# Altium schematic sheet Messsystem.SchDoc: Messsystem
size A4; Author: Andreas Rehn; CompanyName: Hochschule Ulm; Engineer: Andreas Rehn; Organization: Hochschule Ulm; Address1: Institut für Medizintechnik; Address2: und Mechatronik; Address3: Albert-Einstein-Allee 55; Address4: 89081 Ulm; SheetNumber: 2; SheetTotal: 11; ProjectName: Ultrasonic Doppler 2015
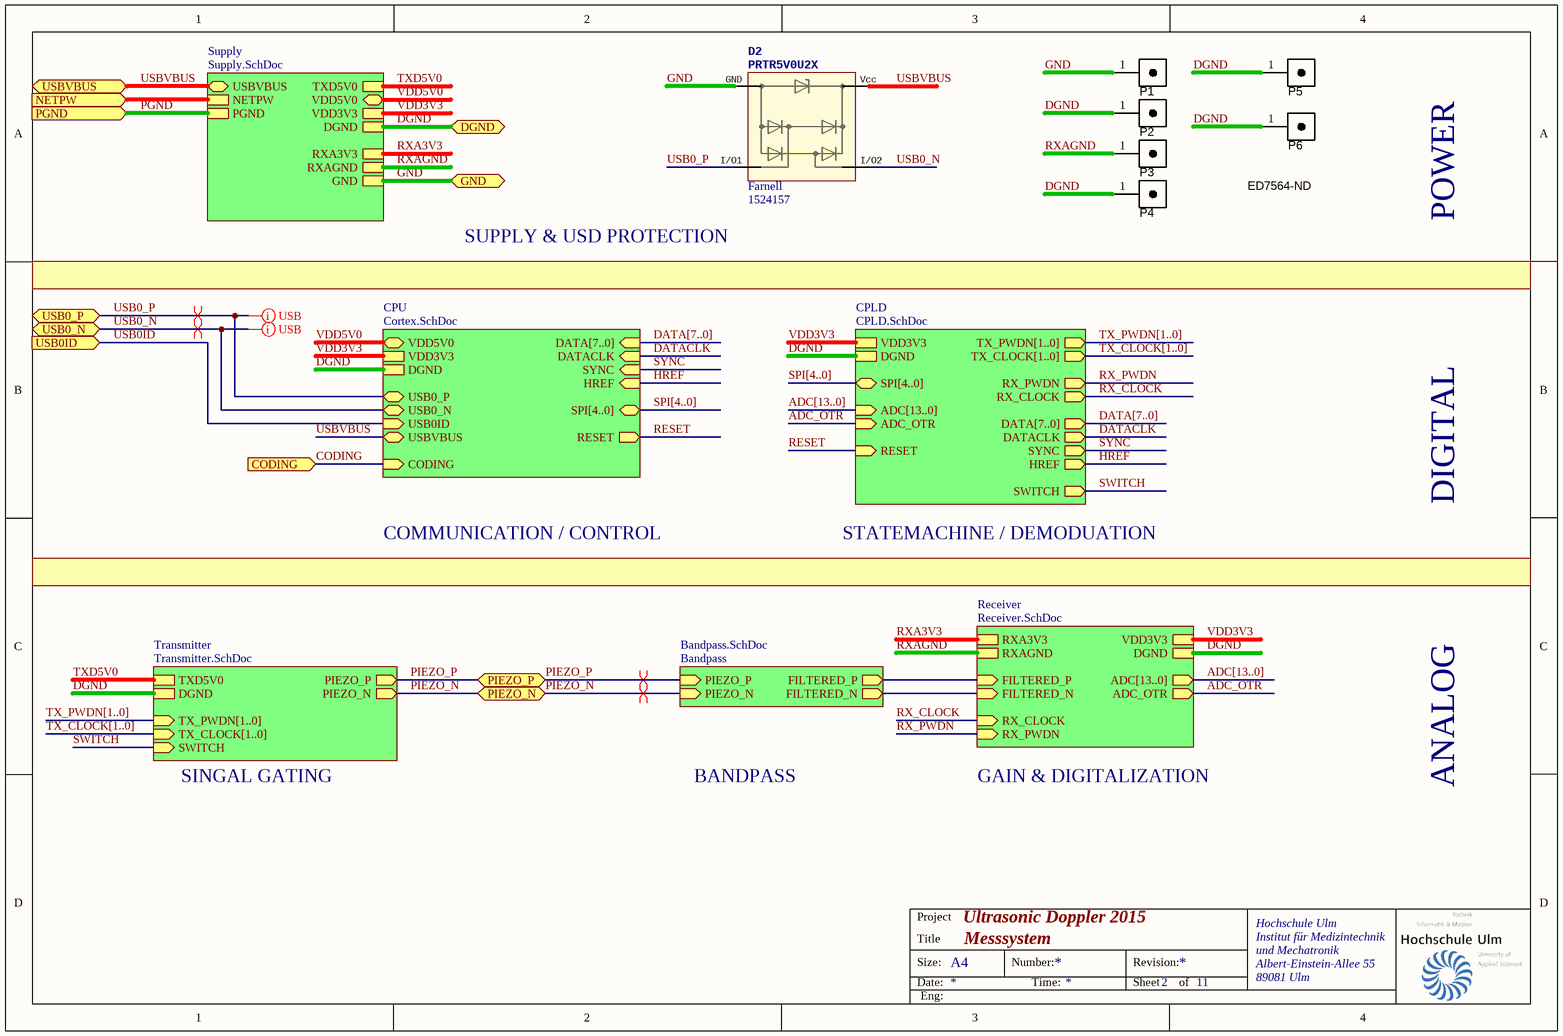
[diagram p0: Messsystem.SchDoc]

## Parts
D2  PRTR5V0U2X  Supplier 1: Farnell  Supplier Part Number 1: 1524157  [SOT143-B]
P1  CONN_HEADER_PLUG_1x1P_0.100in  [1x1POS_HEADER_LOWPROF]  (value not drawn)
P2  CONN_HEADER_PLUG_1x1P_0.100in  [1x1POS_HEADER_LOWPROF]  (value not drawn)
P3  CONN_HEADER_PLUG_1x1P_0.100in  [1x1POS_HEADER_LOWPROF]  (value not drawn)
P4  Supplier Part Number 1: ED7564-ND  [1x1POS_HEADER_LOWPROF]  (hidden comment: CONN_HEADER_PLUG_1x1P_0.100in)
P5  CONN_HEADER_PLUG_1x1P_0.100in  [1x1POS_HEADER_LOWPROF]  (value not drawn)
P6  CONN_HEADER_PLUG_1x1P_0.100in  [1x1POS_HEADER_LOWPROF]  (value not drawn)

## Sub-sheets
Bandpass = Bandpass.SchDoc: FILTERED_P, FILTERED_N, PIEZO_P, PIEZO_N
CPLD = CPLD.SchDoc: DATA[7..0] (out), VDD3V3, DGND, DATACLK (out), SYNC (out), TX_PWDN[1..0] (out), TX_CLOCK[1..0] (out), RX_CLOCK (out), RX_PWDN (out), ADC[13..0] (in), ADC_OTR (in), SPI[4..0], SWITCH (out), HREF (out), RESET (in)
CPU = Cortex.SchDoc: DATA[7..0] (in), VDD3V3, DGND, DATACLK (in), SYNC (in), USB0_P (bidir), USB0_N (bidir), SPI[4..0], USB0ID (in), USBVBUS (bidir), CODING (in), HREF (in), RESET (out), VDD5V0
Receiver = Receiver.SchDoc: RXA3V3, VDD3V3, DGND, ADC[13..0] (out), RX_CLOCK (in), RX_PWDN (in), ADC_OTR (out), FILTERED_P, FILTERED_N, RXAGND
Supply = Supply.SchDoc: USBVBUS (bidir), PGND, TXD5V0, VDD3V3, RXA3V3, DGND, NETPW, VDD5V0, RXAGND, GND
Transmitter = Transmitter.SchDoc: TXD5V0, TX_PWDN[1..0] (in), TX_CLOCK[1..0] (in), DGND, PIEZO_P, PIEZO_N, SWITCH (in)

## Ports
CODING (in), DGND, GND, NETPW, PGND, PIEZO_N, PIEZO_P, USB0_N (bidir), USB0_P (bidir), USB0ID (in), USBVBUS (bidir)

## Nets
ADC_OTR: sheet Receiver/ADC_OTR, sheet CPLD/ADC_OTR
CODING: port CODING, sheet CPU/CODING
DATACLK: sheet CPU/DATACLK, sheet CPLD/DATACLK
DGND: P2.1 P4.1 P5.1 P6.1 ; port DGND, sheet Supply/DGND, sheet Transmitter/DGND, sheet Receiver/DGND, sheet CPU/DGND, sheet CPLD/DGND
GND: D2.GND P1.1 ; port GND, sheet Supply/GND
HREF: sheet CPU/HREF, sheet CPLD/HREF
NETPW: port NETPW, sheet Supply/NETPW
PGND: port PGND, sheet Supply/PGND
PIEZO_N: port PIEZO_N, sheet Transmitter/PIEZO_N, sheet Bandpass/PIEZO_N
PIEZO_P: port PIEZO_P, sheet Transmitter/PIEZO_P, sheet Bandpass/PIEZO_P
RESET: sheet CPU/RESET, sheet CPLD/RESET
RX_CLOCK: sheet Receiver/RX_CLOCK, sheet CPLD/RX_CLOCK
RX_PWDN: sheet Receiver/RX_PWDN, sheet CPLD/RX_PWDN
RXA3V3: sheet Supply/RXA3V3, sheet Receiver/RXA3V3
RXAGND: P3.1 ; sheet Supply/RXAGND, sheet Receiver/RXAGND
SWITCH: sheet Transmitter/SWITCH, sheet CPLD/SWITCH
SYNC: sheet CPU/SYNC, sheet CPLD/SYNC
TXD5V0: sheet Supply/TXD5V0, sheet Transmitter/TXD5V0
USB0_N: D2.I/O2 ; port USB0_N, sheet CPU/USB0_N
USB0_P: D2.I/O1 ; port USB0_P, sheet CPU/USB0_P
USB0ID: port USB0ID, sheet CPU/USB0ID
USBVBUS: D2.Vcc ; port USBVBUS, sheet Supply/USBVBUS, sheet CPU/USBVBUS
VDD3V3: sheet Supply/VDD3V3, sheet Receiver/VDD3V3, sheet CPU/VDD3V3, sheet CPLD/VDD3V3
VDD5V0: sheet Supply/VDD5V0, sheet CPU/VDD5V0
(unnamed): sheet Receiver/FILTERED_P, sheet Bandpass/FILTERED_P
(unnamed): sheet Receiver/FILTERED_N, sheet Bandpass/FILTERED_N

## Buses and harness runs
bus ADC[13..0] = sheet CPLD/ADC[13..0]
bus ADC[13..0] = sheet Receiver/ADC[13..0]
bus DATA[7..0] = sheet CPLD/DATA[7..0]
bus DATA[7..0] = sheet CPU/DATA[7..0]
bus SPI[4..0] = sheet CPLD/SPI[4..0]
bus SPI[4..0] = sheet CPU/SPI[4..0]
bus TX_CLOCK[1..0] = sheet CPLD/TX_CLOCK[1..0]
bus TX_CLOCK[1..0] = sheet Transmitter/TX_CLOCK[1..0]
bus TX_PWDN[1..0] = sheet CPLD/TX_PWDN[1..0]
bus TX_PWDN[1..0] = sheet Transmitter/TX_PWDN[1..0]

## Layout directives
differential pair: PIEZO_N, PIEZO_P, USB0_N, USB0_P
net class USB; rule Matched Net Lengths [Tolerance = 4mm]: USB0_N, USB0_P

## Notes on the sheet
- SUPPLY & USD PROTECTION
- POWER
- DIGITAL
- COMMUNICATION / CONTROL
- STATEMACHINE / DEMODUATION
- SINGAL GATING
- BANDPASS
- GAIN & DIGITALIZATION
- ANALOG
- Project
- Ultrasonic Doppler 2015
- Title
- Size:
- Date:
- A4
- Number:
- Time:
- Revision:
- Sheet
- of
- Eng:

## Library data of the parts
D2 = PRTR5V0: rail-to-rail ESD protection diode; pin to pad: GND>1 I/O1>2 I/O2>3 Vcc>4; value: PRTR5V0U2X
P1-P6 = CONN_HEADER_PLUG_1x1P_0.100in: Pin header for socket THT 1-Pos Low profile Single-row 2.54mm pitch; Manufacturer 1: Mill-Max Manufacturing Corp.; Manufacturer Part Number 1: 800-10-064-10-002000; Pitch: 0.100" (2.54mm); Value: 1x1 Pos.; QtyOverride: 0.02; SCDType: undef; Category: Connectors; Mounting Type: Through Hole; Package / Case: Socket header; 2.54mm pitch; Supplier 1: Digi-Key
  P1-P3 P5 P6: Supplier Part Number 1: ED7564-ND